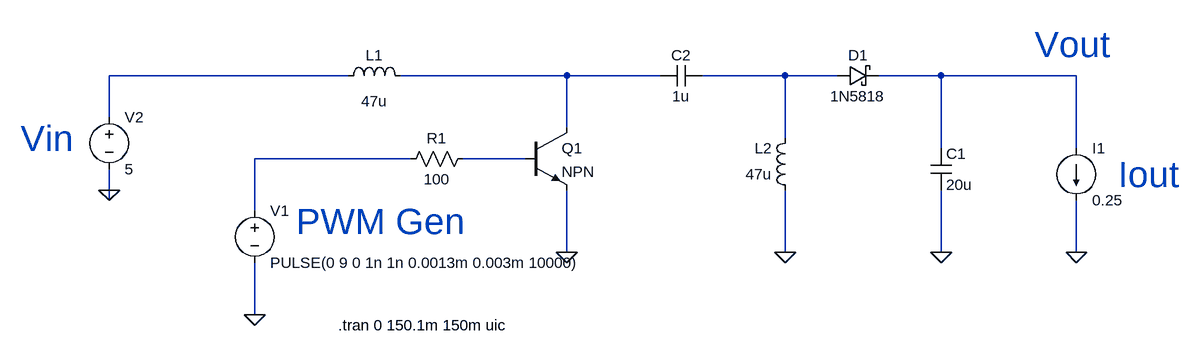
[diagram p0: schematic SEPIC.asc]
SEPIC.asc, the LTspice schematic file:
Version 4
SHEET 1 1512 680
WIRE 208 48 -160 48
WIRE 544 48 288 48
WIRE 688 48 544 48
WIRE 880 48 752 48
WIRE 960 48 880 48
WIRE 1120 48 1024 48
WIRE 1328 48 1120 48
WIRE -160 112 -160 48
WIRE 544 128 544 48
WIRE 880 144 880 48
WIRE 1120 160 1120 48
WIRE 1328 160 1328 48
WIRE 304 176 64 176
WIRE 480 176 384 176
WIRE -160 224 -160 192
WIRE -160 240 -160 224
WIRE 64 256 64 176
WIRE 544 320 544 224
WIRE 880 320 880 224
WIRE 1120 320 1120 224
WIRE 1328 320 1328 240
WIRE 64 416 64 336
FLAG 544 320 0
FLAG 64 416 0
FLAG 1120 320 0
FLAG 1328 320 0
FLAG -160 224 0
FLAG 880 320 0
SYMBOL voltage 64 240 R0
WINDOW 123 0 0 Left 2
WINDOW 39 0 0 Left 2
SYMATTR InstName V1
SYMATTR Value PULSE(0 9 0 1n 1n 0.0013m 0.003m 10000)
SYMBOL schottky 960 64 R270
WINDOW 0 32 32 VTop 2
WINDOW 3 0 32 VBottom 2
SYMATTR InstName D1
SYMATTR Value 1N5818
SYMATTR Description Diode
SYMATTR Type diode
SYMBOL ind 192 64 R270
WINDOW 0 32 56 VTop 2
WINDOW 3 -8 56 VBottom 2
SYMATTR InstName L1
SYMATTR Value 47u
SYMBOL cap 1104 160 R0
SYMATTR InstName C1
SYMATTR Value 20u
SYMBOL current 1328 160 R0
WINDOW 123 0 0 Left 2
WINDOW 39 0 0 Left 2
SYMATTR InstName I1
SYMATTR Value 0.25
SYMBOL voltage -160 96 R0
WINDOW 123 0 0 Left 2
WINDOW 39 0 0 Left 2
SYMATTR InstName V2
SYMATTR Value 5
SYMBOL res 400 160 R90
WINDOW 0 0 56 VBottom 2
WINDOW 3 32 56 VTop 2
SYMATTR InstName R1
SYMATTR Value 100
SYMBOL npn 480 128 R0
SYMATTR InstName Q1
SYMBOL ind 896 240 R180
WINDOW 0 36 80 Left 2
WINDOW 3 36 40 Left 2
SYMATTR InstName L2
SYMATTR Value 47u
SYMBOL cap 752 32 R90
WINDOW 0 0 32 VBottom 2
WINDOW 3 32 32 VTop 2
SYMATTR InstName C2
SYMATTR Value 1u
TEXT 192 432 Left 2 !.tran 0 150.1m 150m uic
TEXT -296 144 Left 5 ;Vin
TEXT 1392 200 Left 5 ;Iout
TEXT 1264 0 Left 5 ;Vout
TEXT 128 272 Left 5 ;PWM Gen

The netlist it stands for:
* SEPIC.asc
V1 N005 0 PULSE(0 9 0 1n 1n 0.0013m 0.003m 10000)
D1 N003 N004 1N5818
L1 N001 N002 47u
C1 N004 0 20u
I1 N004 0 0.25
V2 N001 0 5
R1 N006 N005 100
Q1 N002 N006 0 0 NPN
L2 0 N003 47u
C2 N003 N002 1u
.model D D
.lib standard.dio
.model NPN NPN
.model PNP PNP
.lib standard.bjt
.tran 0 150.1m 150m uic
* Vin
* Iout
* Vout
* PWM Gen
.backanno
.end